# EAGLE schematic glcd2usb-m8 (EAGLE 6.2)
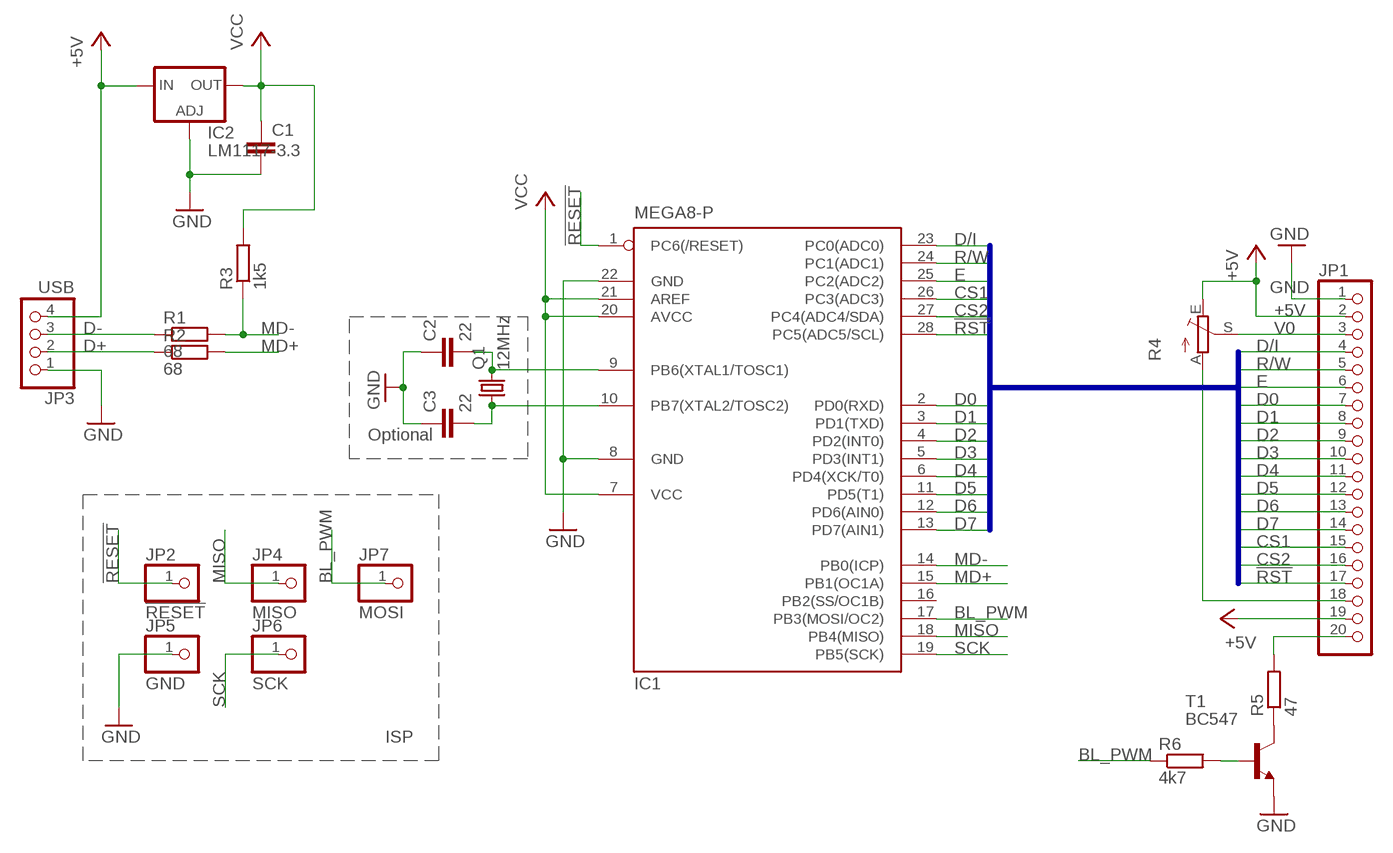
[diagram p0: schematic, sheet 1]

## Parts
C1  C-EUC0603  [C0603]
C2  22  C-EUC0603  [C0603]
C3  22  C-EUC0603  [C0603]
IC1  MEGA8-P  [DIL28-3]
IC2  LM1117-3.3  LM317MBSTT3  [SOT223]
JP1  PINHD-1X20  [1X20]
JP2  !RESET  PINHD-1X1  [1X01]
JP3  USB  PINHD-1X4  [1X04]
JP4  MISO  PINHD-1X1  [1X01]
JP5  GND  PINHD-1X1  [1X01]
JP6  SCK  PINHD-1X1  [1X01]
JP7  MOSI  PINHD-1X1  [1X01]
Q1  12MHz  CRYSTALHC49S  [HC49/S]
R1  68  R-EU_0207/2V  [0207/2V]
R2  68  R-EU_0207/2V  [0207/2V]
R3  1k5  R-EU_0207/2V  [0207/2V]
R4  TRIM_EU-B25P  [B25P]
R5  47  R-EU_0204/2V  [0204V]
R6  4k7  R-EU_0207/2V  [0207/2V]
T1  BC547  [TO92]

## Nets
!RESET: IC1.1(PC6(/RESET)) JP2.1
!RST: IC1.28(PC5(ADC5/SCL)) JP1.17
+5V: IC2.3(IN) JP1.2 JP1.19 JP3.4 R4.E
BL_PWM: IC1.17(PB3(MOSI/OC2)) JP7.1 R6.1
CS1: IC1.26(PC3(ADC3)) JP1.15
CS2: IC1.27(PC4(ADC4/SDA)) JP1.16
D0: IC1.2(PD0(RXD)) JP1.7
D1: IC1.3(PD1(TXD)) JP1.8
D2: IC1.4(PD2(INT0)) JP1.9
D3: IC1.5(PD3(INT1)) JP1.10
D4: IC1.6(PD4(XCK/T0)) JP1.11
D5: IC1.11(PD5(T1)) JP1.12
D6: IC1.12(PD6(AIN0)) JP1.13
D7: IC1.13(PD7(AIN1)) JP1.14
D+: JP3.2 R2.1
D-: JP3.3 R1.1
D/I: IC1.23(PC0(ADC0)) JP1.4
E: IC1.25(PC2(ADC2)) JP1.6
GND: C1.2 C2.1 C3.1 IC1.8(GND) IC1.22(GND) IC2.1(ADJ) JP1.1 JP3.1 JP5.1 T1.1(E)
MD+: IC1.15(PB1(OC1A)) R2.2
MD-: IC1.14(PB0(ICP)) R1.2 R3.1
MISO: IC1.18(PB4(MISO)) JP4.1
N$1: R5.1 T1.3(C)
N$2: JP1.20 R5.2
N$3: C3.2 IC1.10(PB7(XTAL2/TOSC2)) Q1.1
N$4: R6.2 T1.2(B)
N$5: C2.2 IC1.9(PB6(XTAL1/TOSC1)) Q1.2
N$6: JP1.18 R4.A
R/W: IC1.24(PC1(ADC1)) JP1.5
SCK: IC1.19(PB5(SCK)) JP6.1
V0: JP1.3 R4.S
VCC: C1.1 IC1.7(VCC) IC1.20(AVCC) IC1.21(AREF) IC2.4(OUT) R3.2
Unconnected: IC1.16(PB2(SS/OC1B))

## Buses
D0,D1,D2,D3,D4,D5,D6,D7,E,D/I,R/W,CS1,CS2,!RST

## Notes on the sheet
- Optional
- ISP

## Library data of the parts
C1-C3 = resistor:C-EU: CAPACITOR, European symbol
IC1 = atmel:MEGA8-P: MICROCONTROLLER 8 Kbytes FLASH, 1 kbytes SRAM, 512 bytes EEPROM, USART, 4-channel 10 bit ADC, 2-channel 8 bit ADC Pin compatible with Atmega48, ATMega88, ATMega168 Source: avr.lbr; OC_FARNELL: unknown; OC_NEWARK: unknown
IC2 = v-reg:LM317?*: 500 mA Adjustable Output Positive Voltage Regulator Source: http://www.onsemi.co.jp .. LM317M-D.PDF
JP1 = pinhead:PINHD-1X20: PIN HEADER
JP2 JP4-JP7 = pinhead:PINHD-1X1: PIN HEADER
JP3 = pinhead:PINHD-1X4: PIN HEADER
Q1 = crystal:CRYSTAL: CRYSTAL; OC_FARNELL: 1667008; OC_NEWARK: unknown
R1-R3 R5 R6 = resistor:R-EU_: RESISTOR, European symbol
R4 = pot:TRIM_EU-: POTENTIOMETER
T1 = transistor:BC547: NPN TRANSISTOR